# EAGLE design M514X (EAGLE 6.6.0)
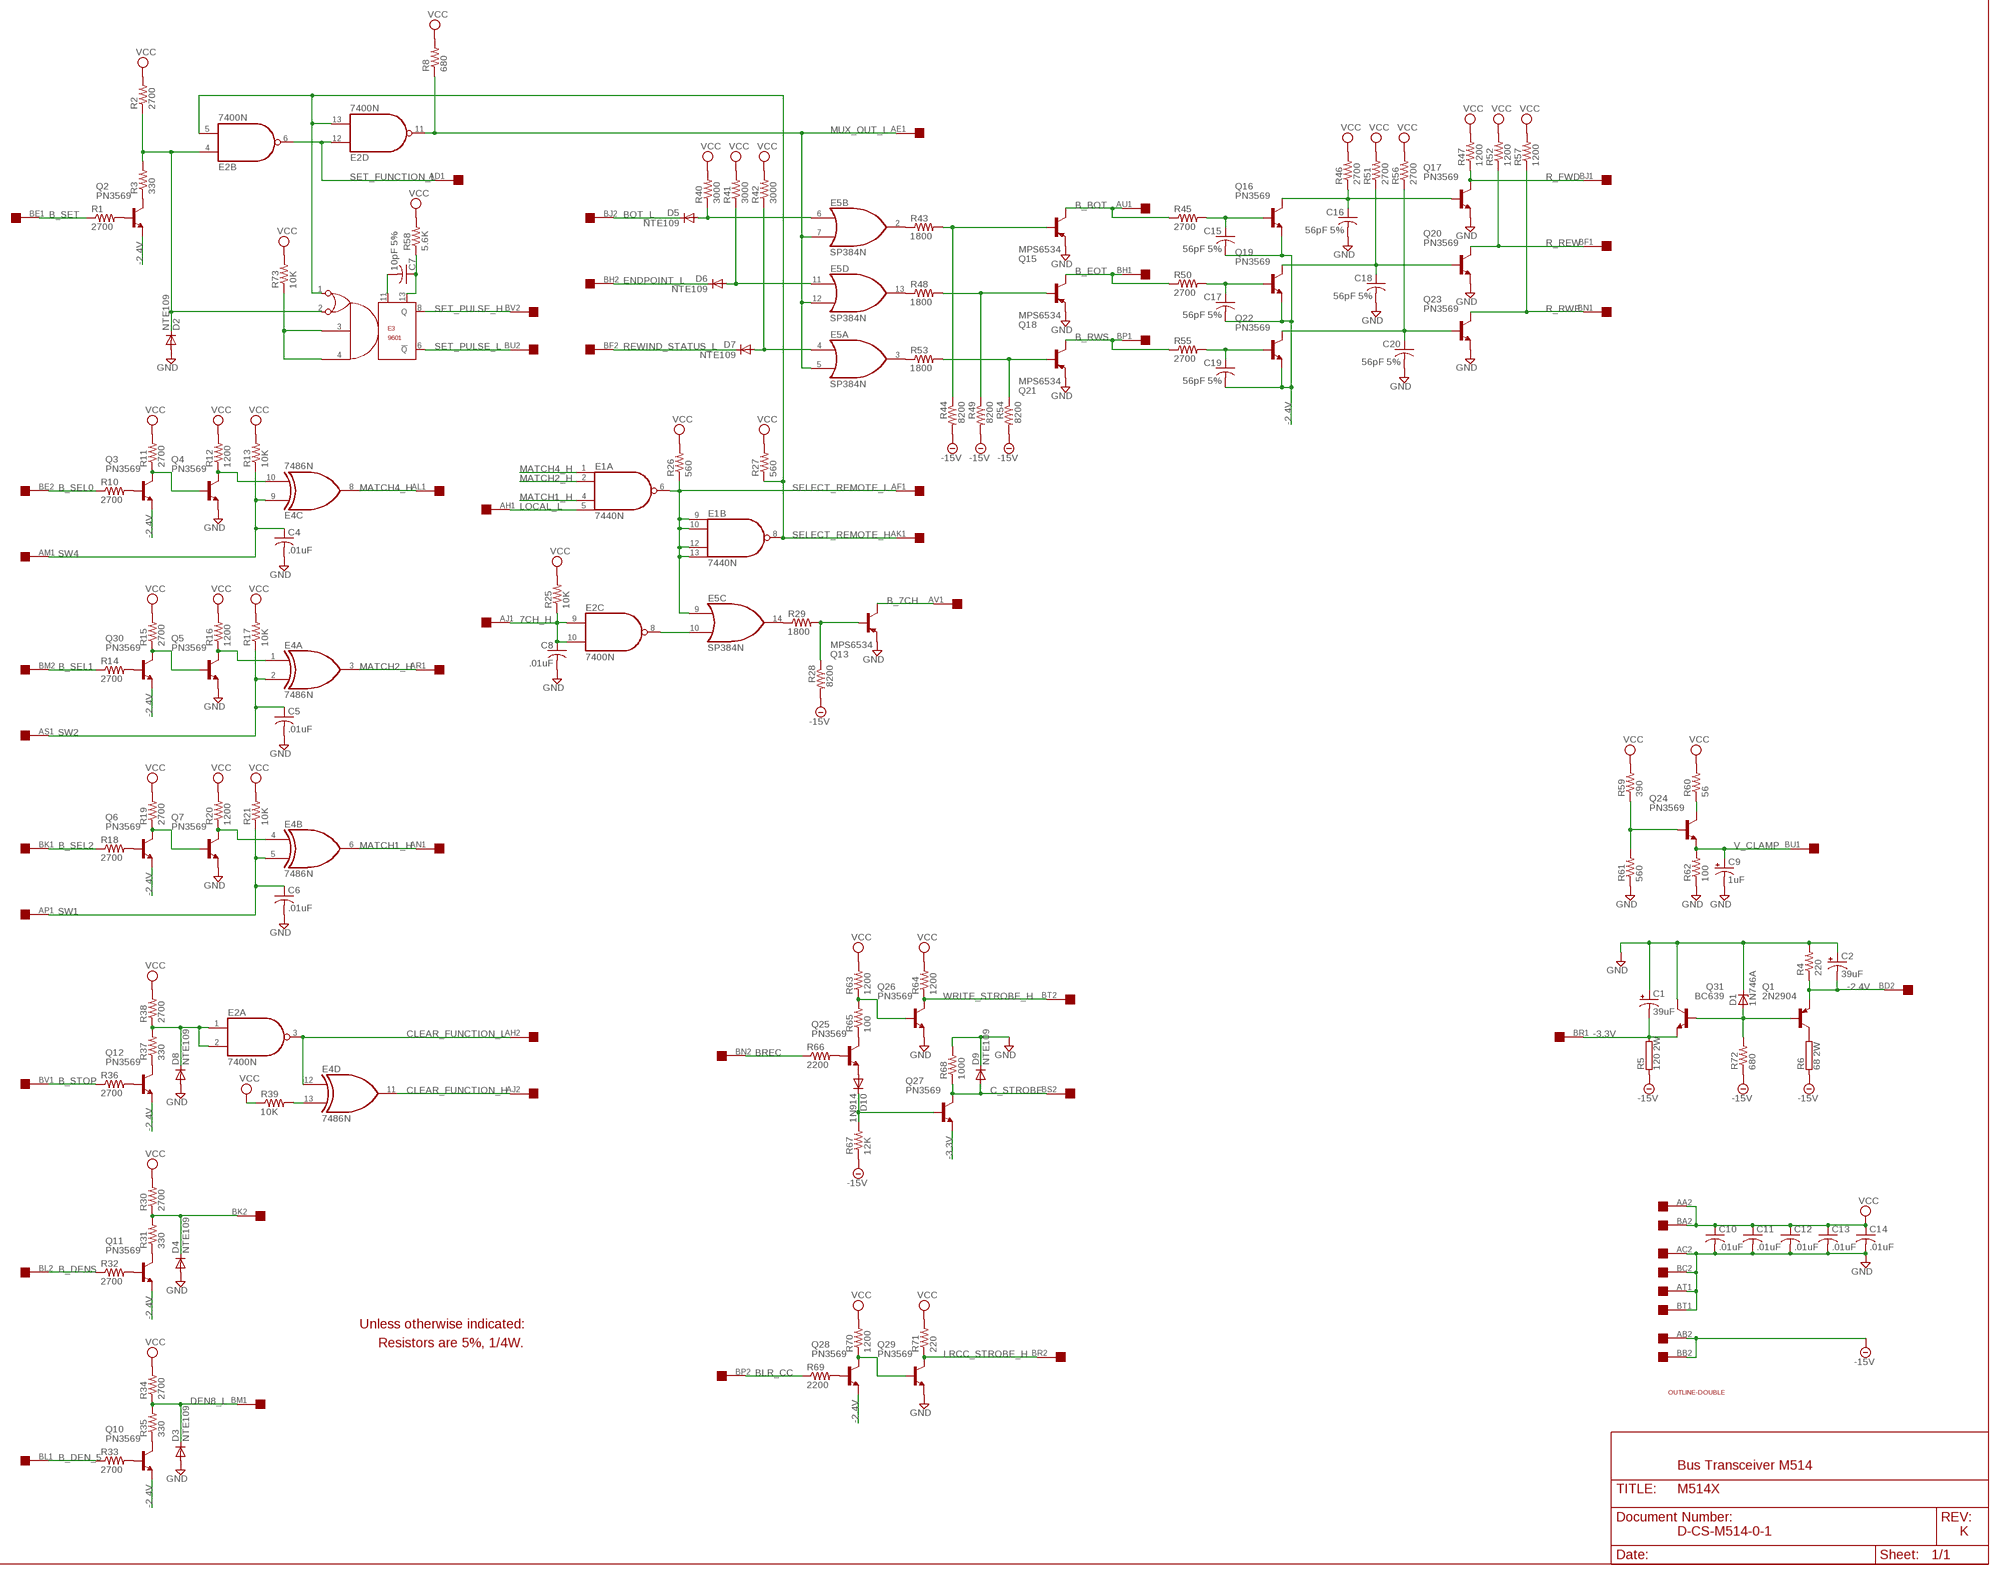
[diagram p0: schematic, sheet 1]

## Parts
C1  39uF  CPOL-USE20-8AXIAL  [E12-8]
C2  39uF  CPOL-USE20-8AXIAL  [E12-8]
C4  .01uF  C-US050-025X075  [C050-025X075]
C5  .01uF  C-US050-025X075  [C050-025X075]
C6  .01uF  C-US050-025X075  [C050-025X075]
C7  10pF 5%  C-US050-025X075  [C050-025X075]
C8  .01uF  C-US050-025X075  [C050-025X075]
C9  1uF  CPOL-USE15-5AXIAL  [E15-5]
C10  .01uF  C-US050-025X075  [C050-025X075]
C11  .01uF  C-US050-025X075  [C050-025X075]
C12  .01uF  C-US050-025X075  [C050-025X075]
C13  .01uF  C-US050-025X075  [C050-025X075]
C14  .01uF  C-US050-025X075  [C050-025X075]
C15  56pF 5%  C-US050-025X075  [C050-025X075]
C16  56pF 5%  C-US050-025X075  [C050-025X075]
C17  56pF 5%  C-US050-025X075  [C050-025X075]
C18  56pF 5%  C-US050-025X075  [C050-025X075]
C19  56pF 5%  C-US050-025X075  [C050-025X075]
C20  56pF 5%  C-US050-025X075  [C050-025X075]
D1  1N746A  ZENER-DIODEDO35Z10  [DO35Z10]
D2  NTE109  1N4148DO35-10  [DO35-10]
D3  NTE109  1N4148DO35-10  [DO35-10]
D4  NTE109  1N4148DO35-10  [DO35-10]
D5  NTE109  1N4148DO35-10  [DO35-10]
D6  NTE109  1N4148DO35-10  [DO35-10]
D7  NTE109  1N4148DO35-10  [DO35-10]
D8  NTE109  1N4148DO35-10  [DO35-10]
D9  NTE109  1N4148DO35-10  [DO35-10]
D10  1N914  1N4148DO35-10  [DO35-10]
E1  7440N  74S20N  [DIL14]
E2  7400N  [DIL14]
E3  9601  [DIL14]
E4  7486N  [DIL14]
E5  SP384N  [DIL14]
Q1  2N2904  2N3635  [TO39]
Q2  PN3569  2N3439  [TO5]
Q3  PN3569  2N3439  [TO5]
Q4  PN3569  2N3439  [TO5]
Q5  PN3569  2N3439  [TO5]
Q6  PN3569  2N3439  [TO5]
Q7  PN3569  2N3439  [TO5]
Q10  PN3569  2N3439  [TO5]
Q11  PN3569  2N3439  [TO5]
Q12  PN3569  2N3439  [TO5]
Q13  MPS6534  2N3635  [TO39]
Q15  MPS6534  2N3635  [TO39]
Q16  PN3569  2N3439  [TO5]
Q17  PN3569  2N3439  [TO5]
Q18  MPS6534  2N3635  [TO39]
Q19  PN3569  2N3439  [TO5]
Q20  PN3569  2N3439  [TO5]
Q21  MPS6534  2N3635  [TO39]
Q22  PN3569  2N3439  [TO5]
Q23  PN3569  2N3439  [TO5]
Q24  PN3569  2N3439  [TO5]
Q25  PN3569  2N3439  [TO5]
Q26  PN3569  2N3439  [TO5]
Q27  PN3569  2N3439  [TO5]
Q28  PN3569  2N3439  [TO5]
Q29  PN3569  2N3439  [TO5]
Q30  PN3569  2N3439  [TO5]
Q31  BC639  2N3439  [TO5]
R1  2700  R-US_0207/10  [0207/10]
R2  2700  R-US_0207/10  [0207/10]
R3  330  R-US_0207/10  [0207/10]
R4  220  R-US_0207/10  [0207/10]
R5  120 2W  RKH206-8  [KH206-8]
R6  68 2W  RKH206-8  [KH206-8]
R8  680  R-US_0207/10  [0207/10]
R10  2700  R-US_0207/10  [0207/10]
R11  2700  R-US_0207/10  [0207/10]
R12  1200  R-US_0207/10  [0207/10]
R13  10K  R-US_0207/10  [0207/10]
R14  2700  R-US_0207/10  [0207/10]
R15  2700  R-US_0207/10  [0207/10]
R16  1200  R-US_0207/10  [0207/10]
R17  10K  R-US_0207/10  [0207/10]
R18  2700  R-US_0207/10  [0207/10]
R19  2700  R-US_0207/10  [0207/10]
R20  1200  R-US_0207/10  [0207/10]
R21  10K  R-US_0207/10  [0207/10]
R25  10K  R-US_0207/10  [0207/10]
R26  560  R-US_0207/10  [0207/10]
R27  560  R-US_0207/10  [0207/10]
R28  8200  R-US_0207/10  [0207/10]
R29  1800  R-US_0207/10  [0207/10]
R30  2700  R-US_0207/10  [0207/10]
R31  330  R-US_0207/10  [0207/10]
R32  2700  R-US_0207/10  [0207/10]
R33  2700  R-US_0207/10  [0207/10]
R34  2700  R-US_0207/10  [0207/10]
R35  330  R-US_0207/10  [0207/10]
R36  2700  R-US_0207/10  [0207/10]
R37  330  R-US_0207/10  [0207/10]
R38  2700  R-US_0207/10  [0207/10]
R39  10K  R-US_0207/10  [0207/10]
R40  3000  R-US_0207/10  [0207/10]
R41  3000  R-US_0207/10  [0207/10]
R42  3000  R-US_0207/10  [0207/10]
R43  1800  R-US_0207/10  [0207/10]
R44  8200  R-US_0207/10  [0207/10]
R45  2700  R-US_0207/10  [0207/10]
R46  2700  R-US_0207/10  [0207/10]
R47  1200  R-US_0207/10  [0207/10]
R48  1800  R-US_0207/10  [0207/10]
R49  8200  R-US_0207/10  [0207/10]
R50  2700  R-US_0207/10  [0207/10]
R51  2700  R-US_0207/10  [0207/10]
R52  1200  R-US_0207/10  [0207/10]
R53  1800  R-US_0207/10  [0207/10]
R54  8200  R-US_0207/10  [0207/10]
R55  2700  R-US_0207/10  [0207/10]
R56  2700  R-US_0207/10  [0207/10]
R57  1200  R-US_0207/10  [0207/10]
R58  5.6K  R-US_0207/10  [0207/10]
R59  390  R-US_0207/10  [0207/10]
R60  56  R-US_0207/10  [0207/10]
R61  560  R-US_0207/10  [0207/10]
R62  100  R-US_0207/10  [0207/10]
R63  1200  R-US_0207/10  [0207/10]
R64  1200  R-US_0207/10  [0207/10]
R65  100  R-US_0207/10  [0207/10]
R66  2200  R-US_0207/10  [0207/10]
R67  12K  R-US_0207/10  [0207/10]
R68  1000  R-US_0207/10  [0207/10]
R69  2200  R-US_0207/10  [0207/10]
R70  1200  R-US_0207/10  [0207/10]
R71  220  R-US_0207/10  [0207/10]
R72  680  R-US_0207/10  [0207/10]
R73  10K  R-US_0207/10  [0207/10]
U$1  DOUBLE  [EDGE-CON4]
U$2  OUTLINE-DOUBLE  [DOUBLE]

## Nets
7CH_H: C8.1 E2.9(C:I0) E2.10(C:I1) R25.1 U$1.AJ1
-2.4V [Supply]: C2.- C15.2 C17.2 C19.2 Q1.1(E) Q2.1(E) Q3.1(E) Q6.1(E) Q10.1(E) Q11.1(E) Q12.1(E) Q16.1(E) Q19.1(E) Q22.1(E) Q28.1(E) Q30.1(E) R4.1 U$1.BD2
-3.3V [Supply]: C1.- Q27.1(E) Q31.1(E) R5.2 U$1.BR1
-15V [Supply]: R5.1 R6.1 R28.2 R44.2 R49.2 R54.2 R67.1 R72.1 U$1.AB2 U$1.BB2
B_7CH: Q13.3(C) U$1.AV1
B_BOT: Q15.3(C) R45.1 U$1.AU1
B_DEN_5: R33.1 U$1.BL1
B_DENS: R32.1 U$1.BL2
B_EOT: Q18.3(C) R50.1 U$1.BH1
B_RWS: Q21.3(C) R55.1 U$1.BP1
B_SEL0: R10.1 U$1.BE2
B_SEL1: R14.1 U$1.BM2
B_SEL2: R18.1 U$1.BK1
B_SET: R1.1 U$1.BE1
B_STOP: R36.1 U$1.BV1
BLR_CC: R69.1 U$1.BP2
BOT_L: D5.C U$1.BJ2
BREC: R66.1 U$1.BN2
C_STROBE: D9.A Q27.3(C) R68.1 U$1.BS2
CLEAR_FUNCTION_H: E4.11(D:O) U$1.AJ2
CLEAR_FUNCTION_L: E2.3(A:O) E4.12(D:I0) U$1.AH2
DEN8_L [Supply]: D3.C R34.1 R35.2 U$1.BM1
ENDPOINT_L: D6.C U$1.BH2
GND [Supply]: C1.+ C2.+ C4.2 C5.2 C6.2 C8.2 C9.- C10.2 C11.2 C12.2 C13.2 C14.2 C16.2 C18.2 C20.2 D1.C D2.A D3.A D4.A D8.A D9.C Q4.1(E) Q5.1(E) Q7.1(E) Q13.1(E) Q15.1(E) Q17.1(E) Q18.1(E) Q20.1(E) Q21.1(E) Q23.1(E) Q26.1(E) Q29.1(E) Q31.3(C) R4.2 R61.1 R62.1 R68.2 U$1.AC2 U$1.AT1 U$1.BC2 U$1.BT1
LOCAL_L: E1.5(A:I3) U$1.AH1
LRCC_STROBE_H: Q29.3(C) R71.1 U$1.BR2
MATCH1_H: E1.4(A:I2) E4.6(B:O) U$1.AN1
MATCH2_H: E1.2(A:I1) E4.3(A:O) U$1.AR1
MATCH4_H: E1.1(A:I0) E4.8(C:O) U$1.AL1
MUX_OUT_L: E2.11(D:O) E5.5(A:I1) E5.7(B:I1) E5.12(D:I1) R8.1 U$1.AE1
N$1: C7.1 E3.13 R58.1
N$2: Q2.3(C) R3.1
N$3: Q2.2(B) R1.2
N$4: D2.C E2.4(B:I0) E3.2 R2.1 R3.2
N$5: E3.3 E3.4 R73.1
N$6: C7.2 E3.11
N$7: Q1.3(C) R6.2
N$8: D1.A Q1.2(B) Q31.2(B) R72.2
N$9: Q3.2(B) R10.2
N$10: E2.8(C:O) E5.10(C:I1)
N$12: Q3.3(C) Q4.2(B) R11.1
N$13: E4.10(C:I1) Q4.3(C) R12.1
N$15: Q12.2(B) R36.2
N$16: Q30.2(B) R14.2
N$17: Q5.2(B) Q30.3(C) R15.1
N$18: E4.1(A:I0) Q5.3(C) R16.1
N$20: Q6.2(B) R18.2
N$21: Q6.3(C) Q7.2(B) R19.1
N$22: E4.4(B:I0) Q7.3(C) R20.1
N$23: Q12.3(C) R37.1
N$24: D5.A E5.6(B:I0) R40.1
N$25: D8.C E2.1(A:I0) E2.2(A:I1) R37.2 R38.1
N$26: Q11.3(C) R31.1
N$27: D6.A E5.11(D:I0) R41.1
N$28: Q11.2(B) R32.2
N$29 [Supply]: D4.C R30.1 R31.2 U$1.BK2
N$30: Q10.3(C) R35.1
N$31: D7.A E5.4(A:I0) R42.1
N$32: Q10.2(B) R33.2
N$33: E5.2(B:O) R43.1
N$34: E5.13(D:O) R48.1
N$35: E5.3(A:O) R53.1
N$36: E5.14(C:O) R29.1
N$37: Q13.2(B) R28.1 R29.2
N$38: Q15.2(B) R43.2 R44.1
N$39: Q18.2(B) R48.2 R49.1
N$40: Q21.2(B) R53.2 R54.1
N$41: E4.13(D:I1) R39.2
N$46: C19.1 Q22.2(B) R55.2
N$47: C17.1 Q19.2(B) R50.2
N$48: C15.1 Q16.2(B) R45.2
N$49: Q28.2(B) R69.2
N$50: Q24.2(B) R59.1 R61.2
N$51: Q24.3(C) R60.1
N$52: C20.1 Q22.3(C) Q23.2(B) R56.1
N$53: C16.1 Q16.3(C) Q17.2(B) R46.1
N$54: C18.1 Q19.3(C) Q20.2(B) R51.1
N$55: Q28.3(C) Q29.2(B) R70.1
N$56: Q25.2(B) R66.2
N$57: D10.A Q25.1(E)
N$58: D10.C Q27.2(B) R67.2
N$59: Q25.3(C) R65.1
N$60: Q26.2(B) R63.1 R65.2
R_FWD: Q17.3(C) R47.1 U$1.BJ1
R_REW: Q20.3(C) R52.1 U$1.BF1
R_RWE: Q23.3(C) R57.1 U$1.BN1
REWIND_STATUS_L: D7.C U$1.BF2
SELECT_REMOTE_H: E1.8(B:O) E2.5(B:I1) E2.13(D:I1) E3.1 R27.1 U$1.AK1
SELECT_REMOTE_L: E1.6(A:O) E1.9(B:I0) E1.10(B:I1) E1.12(B:I2) E1.13(B:I3) E5.9(C:I0) R26.1 U$1.AF1
SET_FUNCTION_L: E2.6(B:O) E2.12(D:I0) U$1.AD1
SET_PULSE_H: E3.8(Q) U$1.BV2
SET_PULSE_L: E3.6(!Q) U$1.BU2
SW1: C6.1 E4.5(B:I1) R21.1 U$1.AP1
SW2: C5.1 E4.2(A:I1) R17.1 U$1.AS1
SW4: C4.1 E4.9(C:I0) R13.1 U$1.AM1
V_CLAMP: C9.+ Q24.1(E) R62.2 U$1.BU1
VCC [Supply]: C10.1 C11.1 C12.1 C13.1 C14.1 R2.2 R8.2 R11.2 R12.2 R13.2 R15.2 R16.2 R17.2 R19.2 R20.2 R21.2 R25.2 R26.2 R27.2 R30.2 R34.2 R38.2 R39.1 R40.2 R41.2 R42.2 R46.2 R47.2 R51.2 R52.2 R56.2 R57.2 R58.2 R59.2 R60.2 R63.2 R64.2 R70.2 R71.2 R73.2 U$1.AA2 U$1.BA2
WRITE_STROBE_H: Q26.3(C) R64.1 U$1.BT2
Unconnected: U$1.AA1 U$1.AB1 U$1.AC1 U$1.AD2 U$1.AE2 U$1.AF2 U$1.AK2 U$1.AL2 U$1.AM2 U$1.AN2 U$1.AP2 U$1.AR2 U$1.AS2 U$1.AT2 U$1.AU2 U$1.AV2 U$1.BA1 U$1.BB1 U$1.BC1 U$1.BD1 U$1.BS1

## Notes on the sheet
- Unless otherwise indicated:
- Resistors are 5%, 1/4W.
- Bus Transceiver M514
- D-CS-M514-0-1 | K

## Power pins joined to a net without a drawn wire
GND: E1.7(P:GND) E2.7(P:GND) E3.7(GND) E4.7(P:GND) E5.1(GND)
VCC: E1.14(P:VCC) E2.14(P:VCC) E3.14(VCC) E4.14(P:VCC) E5.8(VCC)

## Library data of the parts
C1 C2 = dec-con:CPOL-USE20-8AXIAL: A 0.8 inch electrolytic.
C4-C8 C10-C20 = rcl:C-US: CAPACITOR, American symbol
C9 = rcl:CPOL-US: POLARIZED CAPACITOR, American symbol
D1 = diode:ZENER-DIODE: Z-Diode
D2-D10 = diode:1N4148: DIODE high speed (Philips)
E1 = 74xx-us:74*20: Dual 4-input NAND gate
E2 = 74xx-us:74*00: Quad 2-input NAND gate
E3 = dec-con:9601: DEC9601 monstable
E4 = 74xx-us:74*86: Quad 2-input EXCLUSIV-OR (XOR) gate
E5 = dec-con:SP384: Quad OR gate
Q1 Q13 Q15 Q18 Q21 = transistor-pnp:2N3635*: PNP Transistror
Q2-Q7 Q10-Q12 Q16 Q17 Q19 Q20 Q22-Q31 = transistor-npn:2N3439: NPN Transistor
R1-R4 R8 R10-R21 R25-R73 = rcl:R-US_: RESISTOR, American symbol
R5 R6 = resistor-power:R: Power Resitor; OC_FARNELL: unknown; OC_NEWARK: unknown
U$1 = dec-con:DOUBLE: Double-Height DEC board
U$2 = dec-con:OUTLINE-*: Board outlines for DEC boards.

## Net classes
1 Supply: width 0.813 mm

## Board
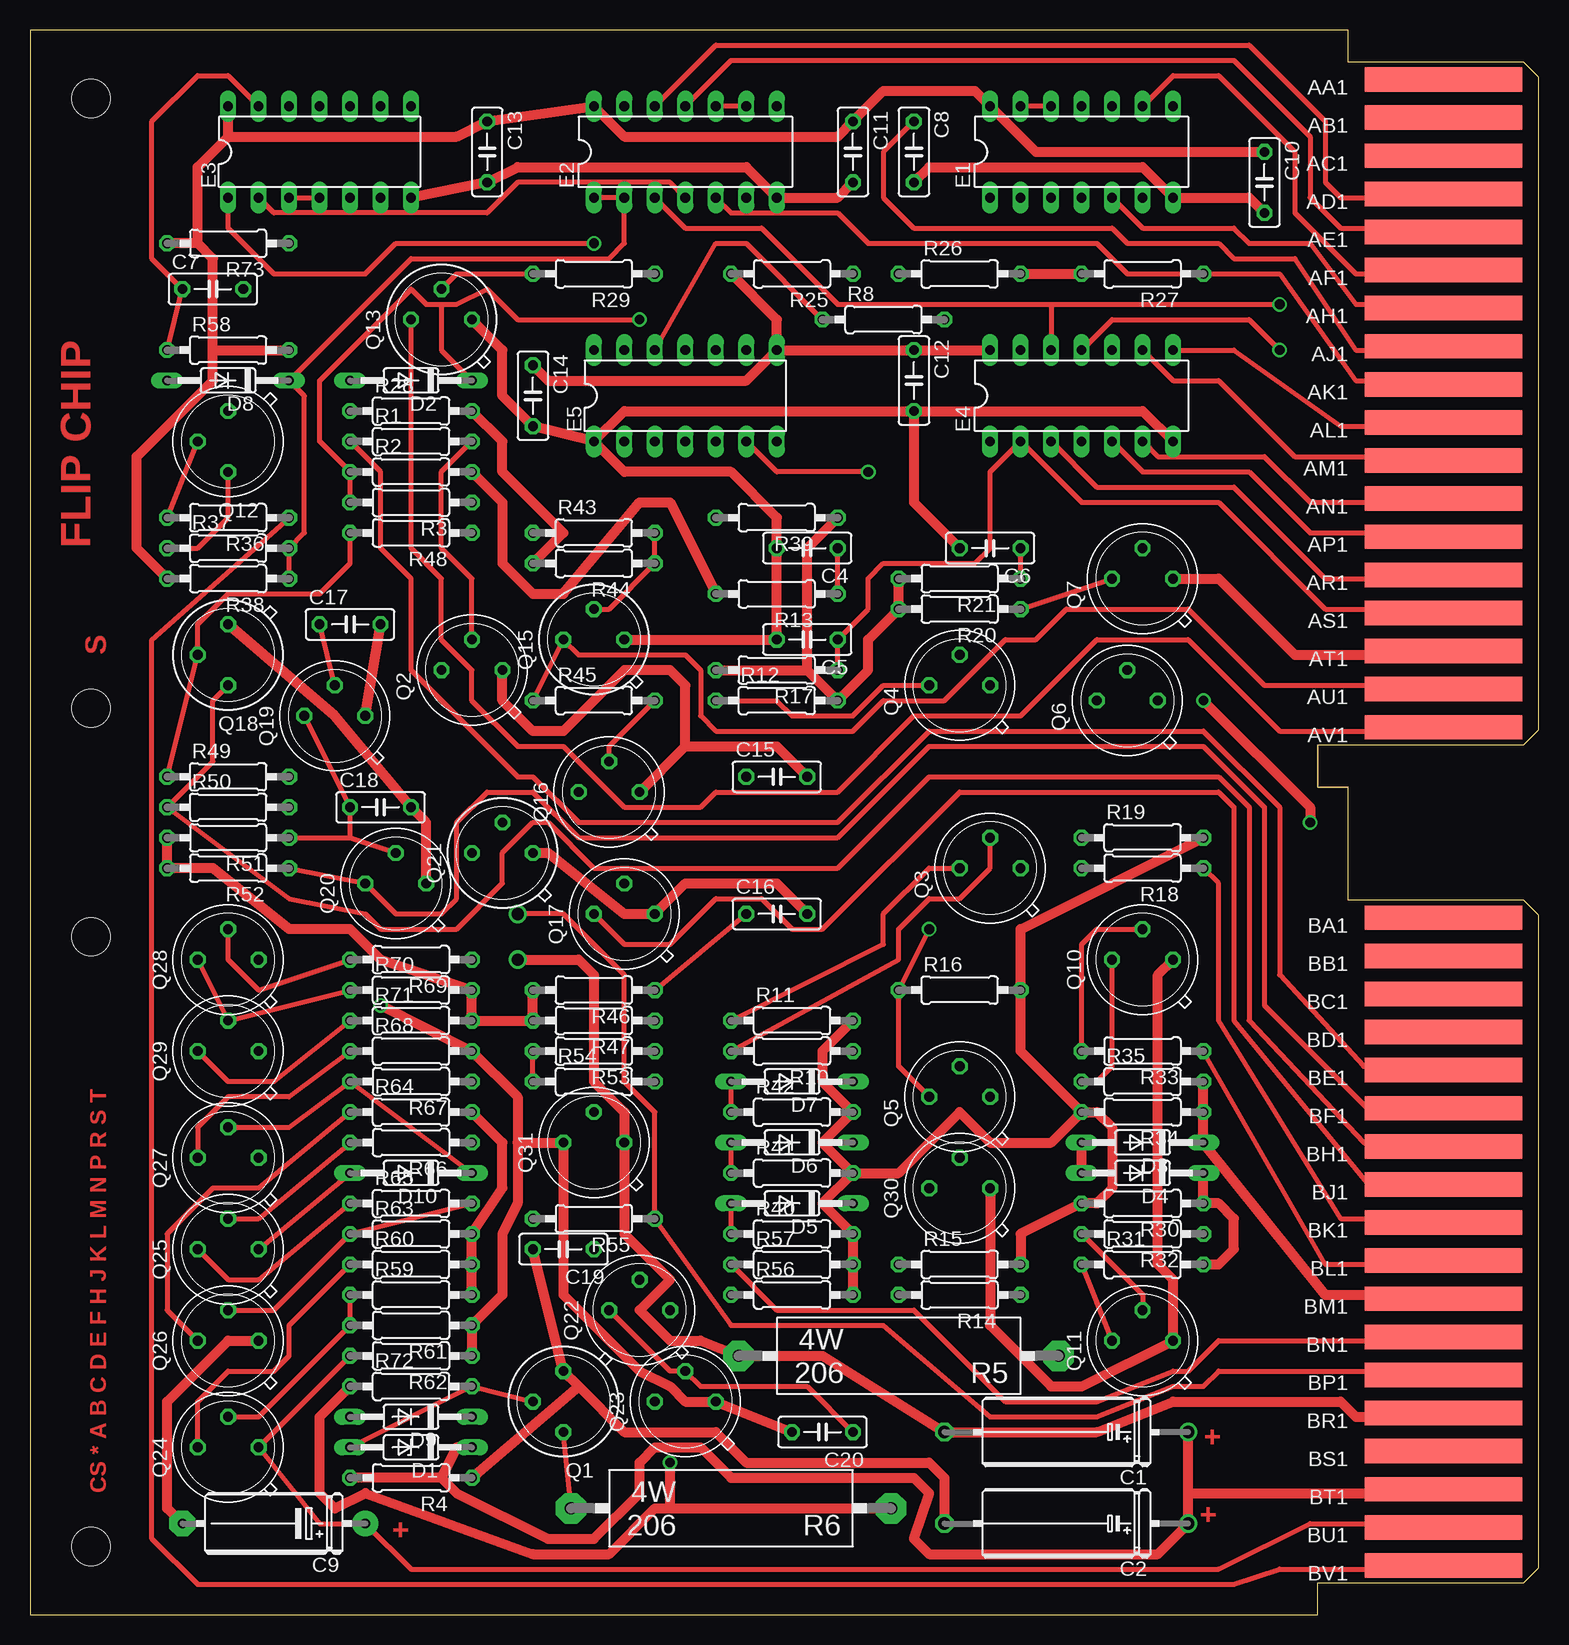
[diagram p1: board, top side]
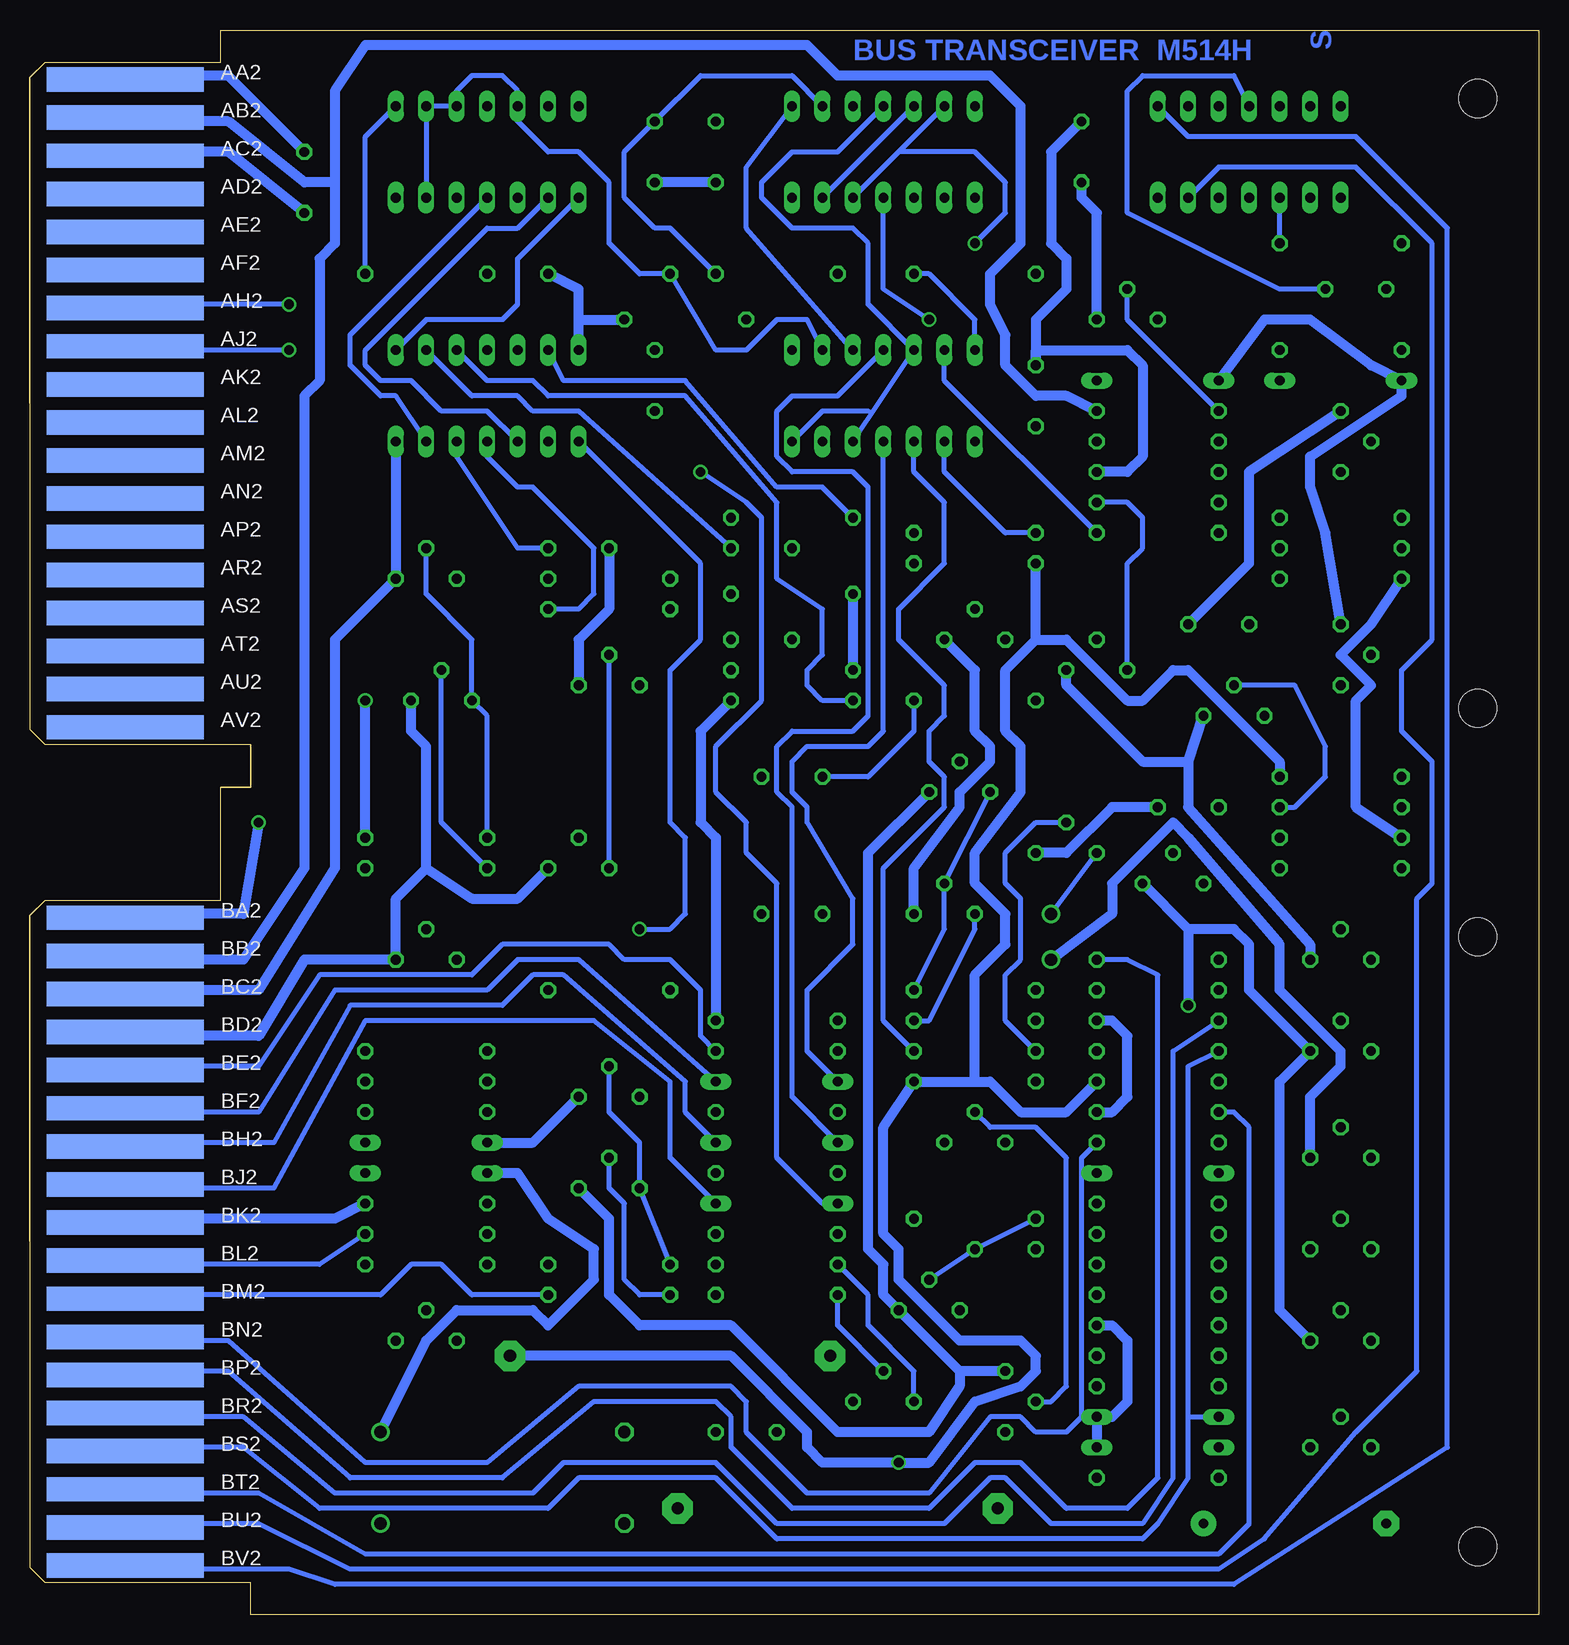
[diagram p2: board, bottom side, seen from below]

Size 125.73 x 132.08 mm. Coordinates in mm from the lower left corner, seen from the top.
Copper layers (1+16): Top 0.035mm / dielectric 1.5mm / Bottom 0.035mm
Design rules "16mils": minimum track width 16mil, minimum drill 32mil, track to track 15mil, track to pad 10mil, pad to pad 10mil, via to via 10mil, smd to smd 10mil, copper to edge 13mil, drill to drill 10mil, minimum pad ring 10mil, minimum via ring 8mil, stop-mask expansion 0mil, vias tented up to drill 0mil, thermal gap 10mil

### Footprints (pad centres in the part's own frame; a part is rotated, then mirrored left to right if it is on the bottom)
E12-8 = drill 1.016: + -10.16,0 | drill 1.016 octagon: - 10.16,0
C050-025X075 = drill 0.813 octagon: 1 -2.54,0; 2 2.54,0
E15-5 = drill 0.813 pad 2.159: + -7.62,0 | drill 0.813 pad 2.159 octagon: - 7.62,0
DO35Z10 = drill 0.813 long: A 5.08,0; C -5.08,0
DO35-10 = drill 0.813 long: A 5.08,0; C -5.08,0
DIL14 = drill 0.813 long: 1 -7.62,-3.81; 2 -5.08,-3.81; 3 -2.54,-3.81; 4 0,-3.81; 5 2.54,-3.81; 6 5.08,-3.81; 7 7.62,-3.81; 8 7.62,3.81; 9 5.08,3.81; 10 2.54,3.81; 11 0,3.81; 12 -2.54,3.81; 13 -5.08,3.81; 14 -7.62,3.81
TO39 = drill 0.813 octagon: 1 0,-2.54; 2 2.54,0; 3 0,2.54
TO5 = drill 0.813 octagon: 1 0,-2.54; 2 2.54,0; 3 0,2.54
0207/10 = drill 0.813 octagon: 1 -5.08,0; 2 5.08,0
KH206-8 = drill 1.016 pad 2.54 octagon: 1 -13.335,0; 2 13.335,0
EDGE-CON4 = smd 13.106 x 2.032: AA1 7.938,4.128; AB1 7.938,7.303; AC1 7.938,10.477; AD1 7.938,13.652; AE1 7.938,16.828; AF1 7.938,20.003; AH1 7.938,23.177; AJ1 7.938,26.352; AK1 7.938,29.527; AL1 7.938,32.703; AM1 7.938,35.877; AN1 7.938,39.053; AP1 7.938,42.227; AR1 7.938,45.403; AS1 7.938,48.578; AT1 7.938,51.752; AU1 7.938,54.928; AV1 7.938,58.102; BA1 7.938,73.978; BB1 7.938,77.153; BC1 7.938,80.328; BD1 7.938,83.502; BE1 7.938,86.677; BF1 7.938,89.853; BH1 7.938,93.028; BJ1 7.938,96.203; BK1 7.938,99.377; BL1 7.938,102.552; BM1 7.938,105.728; BN1 7.938,108.903; BP1 7.938,112.078; BR1 7.938,115.252; BS1 7.938,118.427; BT1 7.938,121.603; BU1 7.938,124.778; BV1 7.938,127.953 | smd 13.106 x 2.032 bottom: AA2 7.938,4.128; AB2 7.938,7.303; AC2 7.938,10.477; AD2 7.938,13.652; AE2 7.938,16.828; AF2 7.938,20.003; AH2 7.938,23.177; AJ2 7.938,26.352; AK2 7.938,29.527; AL2 7.938,32.703; AM2 7.938,35.877; AN2 7.938,39.053; AP2 7.938,42.227; AR2 7.938,45.403; AS2 7.938,48.578; AT2 7.938,51.752; AU2 7.938,54.928; AV2 7.938,58.102; BA2 7.938,73.978; BB2 7.938,77.153; BC2 7.938,80.328; BD2 7.938,83.502; BE2 7.938,86.677; BF2 7.938,89.853; BH2 7.938,93.028; BJ2 7.938,96.203; BK2 7.938,99.377; BL2 7.938,102.552; BM2 7.938,105.728; BN2 7.938,108.903; BP2 7.938,112.078; BR2 7.938,115.252; BS2 7.938,118.427; BT2 7.938,121.603; BU2 7.938,124.778; BV2 7.938,127.953
DOUBLE = hole 3.175: 120.65,56.515; 120.65,5.715; 120.65,75.565; 120.65,126.365

### Placement (x,y rotation side)
C1  86.36,15.24 180 top
C2  86.36,7.62 180 top
C4  64.77,88.9 180 top
C5  64.77,81.28 180 top
C6  80.01,88.9 180 top
C7  15.24,110.49 0 top
C8  73.66,121.92 270 top
C9  20.32,7.62 180 top
C10  102.87,119.38 270 top
C11  68.58,121.92 270 top
C12  73.66,102.87 270 top
C13  38.1,121.92 270 top
C14  41.91,101.6 270 top
C15  62.23,69.85 0 top
C16  62.23,58.42 0 top
C17  26.67,82.55 0 top
C18  29.21,67.31 0 top
C19  44.45,30.48 180 top
C20  66.04,15.24 180 top
D1  31.75,13.97 180 top
D2  31.75,102.87 180 top
D3  92.71,39.37 180 top
D4  92.71,36.83 180 top
D5  63.5,34.29 180 top
D6  63.5,39.37 180 top
D7  63.5,44.45 180 top
D8  16.51,102.87 180 top
D9  31.75,16.51 180 top
D10  31.75,36.83 180 top
E1  87.63,121.92 0 top
E2  54.61,121.92 0 top
E3  24.13,121.92 0 top
E4  87.63,101.6 0 top
E5  54.61,101.6 0 top
Q1  44.45,17.78 180 top
Q2  36.83,78.74 90 top
Q3  80.01,62.23 90 top
Q4  77.47,77.47 90 top
Q5  77.47,43.18 90 top
Q6  91.44,76.2 90 top
Q7  92.71,86.36 90 top
Q10  92.71,54.61 90 top
Q11  92.71,22.86 90 top
Q12  16.51,97.79 180 top
Q13  34.29,107.95 90 top
Q15  46.99,81.28 90 top
Q16  48.26,68.58 90 top
Q17  49.53,58.42 90 top
Q18  16.51,80.01 180 top
Q19  25.4,74.93 90 top
Q20  30.48,60.96 90 top
Q21  39.37,63.5 90 top
Q22  50.8,25.4 90 top
Q23  54.61,17.78 90 top
Q24  16.51,13.97 90 top
Q25  16.51,30.48 90 top
Q26  16.51,22.86 90 top
Q27  16.51,38.1 90 top
Q28  16.51,54.61 90 top
Q29  16.51,46.99 90 top
Q30  77.47,35.56 90 top
Q31  46.99,39.37 90 top
R1  31.75,97.79 0 top
R2  31.75,95.25 0 top
R3  31.75,92.71 180 top
R4  31.75,11.43 180 top
R5  72.39,21.59 180 top
R6  58.42,8.89 180 top
R8  71.12,107.95 0 top
R10  63.5,46.99 180 top
R11  63.5,49.53 0 top
R12  62.23,76.2 0 top
R13  62.23,85.09 180 top
R14  77.47,26.67 180 top
R15  77.47,29.21 0 top
R16  77.47,52.07 0 top
R17  62.23,78.74 180 top
R18  92.71,62.23 180 top
R19  92.71,64.77 0 top
R20  77.47,83.82 180 top
R21  77.47,86.36 180 top
R25  63.5,111.76 180 top
R26  77.47,111.76 0 top
R27  92.71,111.76 180 top
R28  31.75,100.33 0 top
R29  46.99,111.76 180 top
R30  92.71,34.29 180 top
R31  92.71,29.21 0 top
R32  92.71,31.75 180 top
R33  92.71,46.99 180 top
R34  92.71,41.91 180 top
R35  92.71,44.45 0 top
R36  16.51,91.44 180 top
R37  16.51,88.9 0 top
R38  16.51,86.36 180 top
R39  62.23,91.44 180 top
R40  63.5,31.75 0 top
R41  63.5,36.83 0 top
R42  63.5,41.91 0 top
R43  46.99,90.17 0 top
R44  46.99,87.63 180 top
R45  46.99,76.2 0 top
R46  46.99,52.07 180 top
R47  46.99,49.53 180 top
R48  31.75,90.17 180 top
R49  16.51,69.85 0 top
R50  16.51,67.31 0 top
R51  16.51,64.77 180 top
R52  16.51,62.23 180 top
R53  46.99,46.99 180 top
R54  46.99,44.45 0 top
R55  46.99,33.02 180 top
R56  63.5,26.67 0 top
R57  63.5,29.21 0 top
R58  16.51,105.41 0 top
R59  31.75,26.67 0 top
R60  31.75,29.21 0 top
R61  31.75,24.13 180 top
R62  31.75,21.59 180 top
R63  31.75,31.75 0 top
R64  31.75,41.91 0 top
R65  31.75,34.29 0 top
R66  31.75,39.37 180 top
R67  31.75,44.45 180 top
R68  31.75,46.99 0 top
R69  31.75,54.61 180 top
R70  31.75,52.07 0 top
R71  31.75,49.53 0 top
R72  31.75,19.05 0 top
R73  16.51,114.3 180 top
U$1  125.73,132.08 180 top
U$2  125.73,132.08 180 top
U$4  [FLIPCHIP]  0,69.85 0 top

### Tracks (layer width: path | path; a pad name or v marks a point on that pad's centre or on a via)
7CH_H
  Top 0.406: U$1.AJ1 117.17,105.74 116.84,105.41 110.49,105.41 105.41,113.03 100.33,113.03 99.06,114.3 91.44,114.3 90.17,115.57 73.66,115.57 71.12,118.11 71.12,121.92 C8.1 | E2.9 E2.10
  Bottom 0.406: R25.1 72.39,115.57 73.66,115.57 76.2,118.11 76.2,121.92 C8.1 69.85,128.27 62.23,128.27 E2.9
-2.4V
  Top 0.813: Q10.1 93.98,53.34 93.98,29.21 95.25,27.94 Q11.1 87.63,19.05 85.09,19.05 80.01,24.13 Q30.1 | C2.- 76.2,11.43 74.93,12.7 59.69,12.7 57.15,15.24 49.53,15.24 45.72,19.05 | 45.72,19.05 Q1.1 C19.2 | C15.2 62.23,72.39 54.61,72.39 | Q16.1 54.61,72.39 | Q19.1 C17.2 | 54.61,72.39 54.61,77.47 53.34,78.74 49.53,78.74 44.45,73.66 41.91,73.66 39.37,76.2 Q2.1 | R4.1 45.72,19.05
  Bottom 0.813: Q1.1 48.26,20.32 | 48.26,20.32 48.26,19.05 50.8,15.24 58.42,15.24 67.31,24.13 74.93,24.13 77.47,26.67 77.47,33.02 Q30.1 | 48.26,20.32 Q22.1 54.61,26.67 54.61,29.21 55.88,30.48 55.88,63.5 Q16.1 | U$1.BD2 116.84,48.26 106.68,48.26 102.87,54.61 Q10.1 95.25,59.69 92.71,62.23 | 92.71,62.23 88.9,59.69 85.09,59.69 Q3.1 | 92.71,62.23 92.71,72.39 93.98,73.66 Q6.1 | Q28.1 19.05,55.88 29.21,67.31 29.21,71.12 | 29.21,71.12 Q19.1 | 29.21,71.12 33.02,71.12 39.37,77.47 Q2.1 | Q12.1 24.13,95.25 24.13,87.63 C17.2
-3.3V  (via drill 1.02)
  Top 0.813: U$1.BR1 117.17,16.84 116.84,16.51 110.49,16.51 109.22,17.78 95.25,17.78 88.9,15.24 C1.- 66.04,21.59 R5.2 55.88,22.86 53.34,22.86 50.8,25.4 53.34,27.94 49.53,31.75 Q31.1 49.53,41.91 46.99,44.45 46.99,53.34 45.72,54.61 v40.64,54.61
  Bottom 0.813: Q27.1 19.05,43.18 16.51,45.72 16.51,46.99 21.59,52.07 21.59,55.88 29.21,64.77 30.48,66.04 35.56,60.96 35.56,58.42 v40.64,54.61
-15V  (via drill 0.81)
  Top 0.813: 53.34,8.89 R6.1 | 53.34,8.89 v53.34,12.7 | 53.34,8.89 52.07,8.89 48.26,5.08 41.91,5.08 27.94,10.16 25.4,8.89 24.13,10.16 24.13,16.51 R72.1 | R28.2 39.37,97.79 39.37,95.25 44.45,90.17 R44.2
  Bottom 0.813: U$1.BB2 116.84,54.61 107.95,54.61 102.87,62.23 102.87,101.6 101.6,102.87 101.6,113.03 100.33,114.3 100.33,119.38 | 100.33,119.38 100.33,127 97.79,130.81 60.96,130.81 58.42,128.27 45.72,128.27 43.18,125.73 43.18,114.3 45.72,111.76 45.72,109.22 44.45,106.68 44.45,104.14 41.91,101.6 39.37,101.6 R28.2 | U$1.AB2 116.84,124.46 109.22,124.46 102.87,119.38 100.33,119.38 | R67.1 39.37,41.91 43.18,41.91 45.72,44.45 46.99,44.45 | 46.99,44.45 R54.2 54.61,40.64 54.61,31.75 53.34,30.48 53.34,27.94 48.26,22.86 43.18,22.86 41.91,21.59 41.91,20.32 43.18,19.05 46.99,17.78 50.8,12.7 v53.34,12.7 59.69,12.7 60.96,13.97 60.96,15.24 67.31,21.59 R5.1 | 41.91,81.28 R44.2 | 41.91,81.28 44.45,78.74 44.45,73.66 43.18,72.39 43.18,68.58 46.99,63.5 46.99,60.96 44.45,58.42 44.45,55.88 46.99,53.34 46.99,44.45 | 41.91,81.28 39.37,81.28 34.29,76.2 33.02,76.2 30.48,78.74 29.21,78.74 21.59,71.12 R49.2
B_7CH
  Top 0.406: U$1.AV1 117.23,74.05 116.84,73.66 104.14,73.66 96.52,81.28 88.9,81.28 82.55,74.93 73.66,74.93 67.31,68.58 57.15,68.58 55.88,67.31 49.53,67.31 44.45,72.39 40.64,72.39 36.83,76.2 36.83,78.74 34.29,81.28 34.29,86.36 31.75,88.9 Q13.3
B_BOT
  Top 0.406: U$1.AU1 117.17,77.14 116.84,77.47 102.87,77.47 96.52,83.82 86.36,83.82 83.82,81.28 81.28,81.28 76.2,76.2 71.12,76.2 68.58,73.66 57.15,73.66 55.88,74.93 55.88,78.74 54.61,80.01 45.72,80.01 Q15.3 R45.1
B_DEN_5
  Top 0.406: U$1.BL1 117.17,29.54 116.84,29.21 107.95,29.21 R33.1
B_DENS
  Bottom 0.406: U$1.BL2 116.84,29.21 101.6,29.21 R32.1
B_EOT
  Top 0.406: U$1.BH1 117.17,39.04 116.84,39.37 111.12,39.37 101.6,49.53 101.6,67.31 99.06,69.85 74.93,69.85 67.31,62.23 46.99,62.23 43.18,66.04 41.91,66.04 39.37,63.5 39.37,60.96 35.56,57.15 29.21,57.15 27.94,58.42 21.59,59.69 R50.1 15.24,71.12 15.24,76.2 Q18.3
B_RWS  (via drill 1.02)
  Top 0.406: U$1.BP1 117.17,19.99 116.84,20.32 99.06,20.32 97.79,19.05 95.25,19.05 88.9,16.51 80.01,16.51 71.12,24.13 58.42,24.13 R55.1 52.07,41.91 49.53,44.45 49.53,53.34 44.45,58.42 v40.64,58.42
  Bottom 0.406: v40.64,58.42 Q21.3
B_SEL0
  Bottom 0.406: U$1.BE2 116.84,45.72 106.68,45.72 101.6,53.34 88.9,53.34 86.36,55.88 77.47,55.88 76.2,54.61 72.39,54.61 69.85,52.07 69.85,48.26 R10.1
B_SEL1
  Bottom 0.406: U$1.BM2 116.84,26.67 96.52,26.67 93.98,29.21 91.44,29.21 88.9,26.67 R14.1
B_SEL2
  Top 0.406: U$1.BK1 117.14,32.72 116.84,33.02 109.22,33.02 99.06,49.53 99.06,60.96 R18.1
B_SET
  Top 0.406: U$1.BE1 117.17,45.39 116.84,45.72 111.12,45.72 104.14,53.34 104.14,67.31 97.79,73.66 74.93,73.66 67.31,66.04 45.72,66.04 41.91,69.85 40.64,69.85 31.75,78.74 31.75,86.36 29.21,88.9 29.21,95.25 R1.1
B_STOP
  Top 0.406: U$1.BV1 117.23,4.2 116.84,3.81 104.14,3.81 100.33,2.54 13.97,2.54 10.16,6.35 10.16,81.28 R36.1
BLR_CC
  Bottom 0.406: U$1.BP2 116.84,20.32 109.22,20.32 99.06,11.43 86.36,11.43 78.74,17.78 68.58,17.78 67.31,16.51 67.31,13.97 62.23,8.89 50.8,8.89 46.99,12.7 43.18,12.7 39.37,8.89 34.29,8.89 31.75,11.43 31.75,53.34 34.29,54.61 R69.1
BOT_L
  Bottom 0.406: U$1.BJ2 116.84,35.56 105.41,35.56 97.79,49.53 78.74,49.53 72.39,44.45 72.39,38.1 D5.C
BREC
  Bottom 0.406: U$1.BN2 116.84,22.86 109.22,22.86 97.79,12.7 87.63,12.7 80.01,19.05 67.31,19.05 66.04,17.78 66.04,15.24 60.96,10.16 50.8,10.16 45.72,16.51 43.18,16.51 41.91,15.24 39.37,15.24 38.1,16.51 38.1,38.1 R66.1
C_STROBE
  Top 0.406: Q27.3 13.97,40.64 16.51,43.18 21.59,43.18 R68.1
  Bottom 0.406: U$1.BS2 116.84,13.97 107.95,13.97 101.6,8.89 82.55,8.89 80.01,11.43 68.58,11.43 63.5,6.35 33.02,6.35 31.75,7.62 29.21,11.43 29.21,16.51 | 29.21,16.51 D9.A | R68.1 29.21,45.72 29.21,16.51
CLEAR_FUNCTION_H  (via drill 0.81)
  Top 0.406: v104.14,105.41 101.6,107.95 90.17,107.95 E4.11
  Bottom 0.406: U$1.AJ2 116.84,105.41 v104.14,105.41
CLEAR_FUNCTION_L  (via drill 0.81)
  Top 0.406: 85.09,109.22 v104.14,109.22 | 85.09,109.22 E4.12 | E2.3 54.61,115.57 60.96,115.57 67.31,109.22 85.09,109.22
  Bottom 0.406: U$1.AH2 116.84,109.22 v104.14,109.22
DEN8_L
  Top 0.813: U$1.BM1 117.17,26.34 116.84,26.67 107.95,26.67 D3.C R34.1 R35.2
ENDPOINT_L
  Bottom 0.406: U$1.BH2 116.84,39.37 105.41,39.37 99.06,50.8 86.36,50.8 83.82,53.34 81.28,53.34 71.12,44.45 71.12,41.91 D6.C
GND  (via drill 0.81)
  Top 0.813: U$1.BT1 116.84,10.16 96.52,10.16 | 96.52,10.16 C2.+ 93.98,5.08 74.93,5.08 73.66,6.35 74.93,10.16 73.66,11.43 58.42,11.43 55.88,13.97 52.07,13.97 50.8,12.7 50.8,10.16 46.99,6.35 43.18,6.35 35.56,10.16 34.29,11.43 | 96.52,10.16 C1.+ | E4.7 92.71,100.33 C12.2 | C12.2 49.53,100.33 E5.1 | C10.2 101.6,118.11 E1.7 92.71,120.65 74.93,120.65 C8.2 | C11.2 67.31,118.11 E2.7 59.69,120.65 40.64,120.65 C13.2 E3.7 | U$1.AT1 117.17,80.34 116.84,80.01 105.41,80.01 99.06,86.36 Q7.1 | E5.1 C14.2 39.37,101.6 39.37,105.41 Q13.1 | D4.A D3.A | R62.1 R61.1 39.37,26.67 39.37,31.75 40.64,34.29 40.64,39.37 | C16.2 62.23,60.96 54.61,60.96 Q17.1 49.53,58.42 43.18,63.5 Q21.1 | 40.64,39.37 Q31.3 44.45,26.67 50.8,20.32 53.34,19.05 54.61,17.78 Q23.1 C20.2 | 40.64,39.37 40.64,43.18 R68.2 v29.21,50.8 | D1.C 35.56,13.97 34.29,11.43 | 34.29,11.43 R4.2 | Q15.1 C5.2 C4.2 62.23,91.44 58.42,95.25 49.53,95.25 E5.1 | C6.2 73.66,92.71 C12.2 | C9.- 11.43,8.89 11.43,17.78 16.51,22.86 Q26.1 | Q20.1 33.02,66.04 C18.2 25.4,74.93 Q18.1
  Bottom 0.813: C1.+ 92.71,22.86 90.17,25.4 83.82,25.4 82.55,24.13 78.74,27.94 78.74,30.48 82.55,33.02 85.09,36.83 D4.A | E4.7 Q7.1 100.33,81.28 100.33,62.23 106.68,52.07 116.84,52.07 U$1.BC2 | U$1.AC2 117.73,121.92 109.22,121.92 C10.2 | Q26.1 21.59,25.4 21.59,44.45 Q29.1 24.13,52.07 24.13,55.88 25.4,57.15 29.21,57.15 | 29.21,57.15 v29.21,50.8 | 29.21,57.15 Q20.1 | C11.2 C8.2 | Q15.1 46.99,78.74 46.99,73.66 45.72,72.39 45.72,71.12 48.26,68.58 48.26,67.31 52.07,62.23 Q17.1 | C13.2 38.1,118.11 36.83,116.84 Q13.1 | D3.A 83.82,39.37 Q5.1 | R61.1 35.56,24.13 34.29,22.86 34.29,17.78 35.56,16.51 D9.C D1.C | C6.2 77.47,83.82 80.01,81.28 Q4.1 | Q21.1 39.37,63.5 35.56,67.31 C18.2 | D2.A 22.86,107.95 19.05,107.95 13.97,104.14 D8.A 11.43,101.6 19.05,96.52 19.05,93.98 17.78,90.17 Q18.1
LOCAL_L
  Top 0.406: U$1.AH1 117.17,108.89 116.84,109.22 110.49,109.22 106.68,114.3 101.6,114.3 100.33,115.57 92.71,115.57 E1.5
LRCC_STROBE_H
  Top 0.406: Q29.3 16.51,44.45 20.32,44.45 R71.1
  Bottom 0.406: U$1.BR2 116.84,16.51 107.95,16.51 100.33,10.16 83.82,10.16 81.28,12.7 68.58,12.7 63.5,7.62 49.53,7.62 45.72,11.43 44.45,11.43 40.64,7.62 33.02,7.62 30.48,11.43 30.48,46.99 R71.1
MATCH1_H
  Top 0.406: U$1.AN1 117.17,93.04 116.84,92.71 106.68,92.71 102.87,96.52 93.98,96.52 E4.6
  Bottom 0.406: E4.6 95.25,101.6 96.52,101.6 99.06,104.14 99.06,106.68 E1.4
MATCH2_H
  Top 0.406: U$1.AR1 117.17,86.69 116.84,86.36 107.95,86.36 100.33,93.98 88.9,93.98 E4.3
  Bottom 0.406: E1.2 85.09,115.57 87.63,115.57 97.79,105.41 97.79,104.14 96.52,102.87 93.98,102.87 91.44,100.33 87.63,100.33 E4.3
MATCH4_H
  Top 0.406: U$1.AL1 117.17,99.39 116.84,99.06 109.22,99.06 100.33,105.41 E4.8
  Bottom 0.406: E1.1 85.09,113.03 85.09,109.22 86.36,107.95 92.71,107.95 E4.8
MUX_OUT_L
  Top 0.406: U$1.AE1 117.17,115.24 116.84,115.57 109.22,115.57 106.68,118.11 106.68,123.19 100.33,129.54 58.42,129.54 E2.11 | R8.1 59.69,114.3 57.15,114.3 E5.12
  Bottom 0.406: E2.11 58.42,121.92 62.23,121.92 64.77,119.38 64.77,118.11 62.23,115.57 57.15,115.57 55.88,114.3 55.88,109.22 E5.12 55.59,100.14 | E5.5 55.59,100.14 | E5.7 59.69,100.33 55.88,100.33 55.59,100.14
N$1
  Top 0.406: E3.13 16.51,128.27 13.97,128.27 10.16,124.46 10.16,113.03 C7.1 R58.1
N$2
  Bottom 0.406: R3.1 34.29,92.71 33.02,91.44 33.02,88.9 34.29,87.63 Q2.3
N$3
  Top 0.406: R1.2 34.29,95.25 34.29,88.9 36.83,86.36 Q2.2
N$4  (via drill 0.81)
  Top 0.406: E3.2 20.32,116.84 38.1,116.84 40.64,119.38 53.34,119.38 E2.4 | v50.8,107.95 40.64,107.95 38.1,110.49 35.56,109.22 34.29,109.22 | 34.29,109.22 33.02,109.22 31.75,110.49 24.13,102.87 24.13,97.79 R2.1 R3.2 | 34.29,109.22 34.29,105.41 D2.C
  Bottom 0.406: E2.4 54.61,110.49 v50.8,107.95
N$5
  Top 0.406: E3.3 E3.4
  Bottom 0.406: R73.1 E3.3
N$6
  Bottom 0.406: E3.11 25.4,128.27 33.02,128.27 34.29,127 34.29,116.84 21.59,110.49 C7.2
N$7
  Top 0.406: R6.2 Q1.3
N$8
  Top 0.406: Q1.2 R72.2 D1.A
  Bottom 0.406: Q1.2 40.64,17.78 39.37,19.05 39.37,38.1 41.91,40.64 45.72,40.64 Q31.2
N$9
  Top 0.406: R10.2 72.39,54.61 72.39,57.15 74.93,59.69 77.47,59.69 80.01,62.23 Q3.2
N$10
  Bottom 0.406: E2.8 66.04,120.65 66.04,115.57 E5.10
N$12
  Top 0.406: Q3.3 74.93,62.23 71.12,58.42 71.12,55.88 R11.1
  Bottom 0.406: Q3.3 Q4.2
N$13
  Top 0.406: Q4.3 71.12,77.47 68.58,74.93 63.5,74.93 62.23,76.2 R12.1
  Bottom 0.406: E4.10 87.63,102.87 83.82,102.87 82.55,101.6 71.12,101.6 63.5,92.71 63.5,86.36 59.69,83.82 59.69,80.01 60.96,78.74 60.96,77.47 59.69,76.2 R12.1
N$15
  Top 0.406: R36.2 Q12.2
N$16
  Bottom 0.406: Q30.2 77.47,35.56 76.2,34.29 76.2,27.94 74.93,26.67 R14.2
N$17
  Bottom 0.406: Q5.2 77.47,41.91 74.93,39.37 Q30.3 R15.1
N$18  (via drill 0.81)
  Top 0.406: v74.93,57.15 R16.1 72.39,45.72 Q5.3
  Bottom 0.406: E4.1 69.85,87.63 69.85,81.28 72.39,78.74 72.39,66.04 71.12,64.77 71.12,58.42 72.39,57.15 v74.93,57.15
N$20
  Bottom 0.406: R18.2 91.44,66.04 Q6.2
N$21
  Bottom 0.406: R19.1 87.63,74.93 Q6.3 88.9,81.28 92.71,85.09 Q7.2
N$22
  Top 0.406: R20.1 Q7.3
  Bottom 0.406: E4.4 87.63,96.52 85.09,93.98 83.82,93.98 78.74,88.9 78.74,85.09 80.01,83.82 R20.1
N$23
  Top 0.406: R37.1 13.97,88.9 16.51,91.44 Q12.3
N$24  (via drill 0.81)
  Top 0.406: R40.1 D5.A | E5.6 62.23,95.25 v69.85,95.25
  Bottom 0.406: D5.A 59.69,34.29 63.5,38.1 63.5,60.96 66.04,63.5 66.04,66.04 68.58,68.58 68.58,72.39 64.77,76.2 64.77,91.44 66.04,92.71 v69.85,95.25
N$25
  Top 0.406: E2.1 E2.2 49.53,114.3 48.26,113.03 31.75,113.03 D8.C 22.86,101.6 22.86,90.17 R37.2 R38.1
N$26
  Top 0.406: Q11.3 R31.1
N$27
  Top 0.406: R41.1 D6.A
  Bottom 0.406: E5.11 58.42,101.6 62.23,101.6 63.5,100.33 63.5,96.52 62.23,95.25 57.15,95.25 55.88,93.98 55.88,74.93 57.15,73.66 62.23,73.66 63.5,72.39 63.5,68.58 62.23,67.31 62.23,43.18 D6.A
N$28
  Top 0.406: R32.2 92.71,26.67 Q11.2
N$29
  Top 0.813: R31.2 99.06,29.21 100.33,30.48 100.33,33.02 99.06,34.29 R30.1 D4.C
  Bottom 0.813: U$1.BK2 116.84,33.02 100.33,33.02 R30.1
N$30
  Top 0.406: R35.1 88.9,44.45 90.17,45.72 Q10.3
N$31
  Top 0.406: R42.1 D7.A
  Bottom 0.406: E5.4 54.61,73.66 55.88,72.39 60.96,72.39 62.23,71.12 62.23,68.58 60.96,67.31 60.96,66.04 57.15,59.69 57.15,55.88 60.96,52.07 60.96,46.99 D7.A
N$32
  Top 0.406: R33.2 87.63,55.88 88.9,57.15 Q10.2
N$33
  Bottom 0.406: E5.2 49.53,95.25 44.45,90.17 R43.1
N$34
  Bottom 0.406: E5.13 49.53,102.87 R48.1
N$35
  Bottom 0.406: E5.3 52.07,95.25 49.53,92.71 49.53,87.63 53.34,83.82 53.34,81.28 49.53,77.47 49.53,74.93 50.8,73.66 50.8,71.12 49.53,69.85 49.53,67.31 54.61,62.23 54.61,49.53 R53.1
N$36
  Bottom 0.406: E5.14 46.99,107.95 50.8,111.76 R29.1
N$37
  Top 0.406: R29.2 35.56,111.76 Q13.2
  Bottom 0.406: R28.1 34.29,107.95 Q13.2
N$38
  Top 0.406: Q15.2 48.26,83.82 R44.1 R43.2
N$39
  Top 0.406: R49.1 Q18.2 13.97,82.55 16.51,85.09 24.13,85.09 26.67,87.63 R48.2
N$40
  Top 0.406: R54.1 R53.2
  Bottom 0.406: R53.2 44.45,49.53 44.45,53.34 43.18,54.61 43.18,59.69 44.45,60.96 44.45,63.5 41.91,66.04 Q21.2
N$41
  Bottom 0.406: E4.13 81.28,102.87 71.12,102.87 63.5,93.98 59.69,93.98 R39.2
N$46
  Bottom 0.406: R55.2 C19.1 Q22.2
N$47
  Top 0.406: Q19.2 C17.1
  Bottom 0.406: R50.2 20.32,67.31 17.78,69.85 17.78,72.39 20.32,77.47 Q19.2
N$48
  Top 0.406: Q16.2 48.26,72.39 R45.2
  Bottom 0.406: R45.2 52.07,73.66 55.88,69.85 C15.1
N$49
  Top 0.406: Q28.2 16.51,54.61 19.05,52.07 R69.2
N$50
  Top 0.406: Q24.2 19.05,16.51 R61.2 R59.1
N$51
  Top 0.406: Q24.3 13.97,17.78 16.51,20.32 20.32,20.32 21.59,21.59 21.59,24.13 R60.1
N$52
  Top 0.406: Q22.3 53.34,20.32 Q23.2 55.88,19.05 64.77,19.05 C20.1
  Bottom 0.406: R56.1 58.42,24.13 Q23.2
N$53
  Top 0.406: R46.1 C16.1
  Bottom 0.406: Q16.3 Q17.2 49.53,57.15 R46.1
N$54
  Top 0.406: R51.1 26.67,64.77 | 26.67,64.77 Q20.2 | 26.67,64.77 C18.1 Q19.3
N$55
  Top 0.406: R70.1 Q29.2 Q28.3
N$56
  Top 0.406: Q25.2 19.05,33.02 R66.2
N$57
  Top 0.406: Q25.1 D10.A
N$58
  Top 0.406: Q27.2 21.59,40.64 R67.2 D10.C
N$59
  Top 0.406: Q25.3 16.51,27.94 19.05,27.94 R65.1
N$60
  Top 0.406: Q26.2 20.32,25.4 R63.1 R65.2
R_FWD
  Top 0.406: U$1.BJ1 117.17,35.89 116.84,35.56 111.76,35.56 100.33,49.53 100.33,67.31 99.06,68.58 77.47,68.58 66.04,57.15 63.5,57.15 60.96,59.69 57.15,59.69 53.34,55.88 49.53,55.88 Q17.3
  Bottom 0.406: R47.1 50.8,49.53 46.99,57.15 Q17.3
R_REW
  Top 0.406: U$1.BF1 117.12,42.19 116.84,41.91 111.76,41.91 102.87,50.8 102.87,67.31 97.79,72.39 74.93,72.39 67.31,64.77 45.72,64.77 41.91,68.58 38.1,68.58 35.56,66.04 35.56,59.69 34.29,58.42 30.48,58.42 Q20.3 R52.1
R_RWE
  Top 0.406: U$1.BN1 117.17,23.19 116.84,22.86 99.06,22.86 96.52,20.32 95.25,20.32 88.9,17.78 81.28,17.78 73.66,25.4 62.23,25.4 R57.1
  Bottom 0.406: R57.1 55.88,26.67 55.88,24.13 52.07,20.32 Q23.3
REWIND_STATUS_L
  Bottom 0.406: U$1.BF2 116.84,41.91 106.68,41.91 100.33,52.07 87.63,52.07 85.09,54.61 80.01,54.61 D7.C
SELECT_REMOTE_H  (via drill 0.81)
  Top 0.406: U$1.AK1 117.14,102.56 116.84,102.87 110.49,102.87 104.14,111.76 R27.1 91.44,111.76 88.9,114.3 69.85,114.3 67.31,116.84 58.42,116.84 E2.5 | E3.1 16.51,115.57 20.32,111.76 27.94,111.76 30.48,114.3 v46.99,114.3
  Bottom 0.406: E2.5 E2.13 53.34,121.92 46.99,121.92 44.45,119.38 44.45,116.84 v46.99,114.3 | E1.8 97.79,123.19 R27.1
SELECT_REMOTE_L
  Top 0.406: E1.12 E1.13 | U$1.AF1 117.12,112.04 116.84,111.76 110.49,111.76 105.41,116.84 105.41,121.92 99.06,128.27 95.25,128.27 E1.9
  Bottom 0.406: E1.6 E1.9 E1.10 90.17,127 88.9,128.27 86.36,128.27 85.09,127 E1.12 85.09,124.46 82.55,121.92 80.01,121.92 77.47,119.38 77.47,114.3 74.93,111.76 R26.1 68.58,105.41 66.04,105.41 63.5,107.95 60.96,107.95 E5.9
SET_FUNCTION_L
  Top 0.406: U$1.AD1 117.14,118.42 116.84,118.11 109.22,118.11 107.95,119.38 107.95,124.46 101.6,130.81 57.15,130.81 E2.12
  Bottom 0.406: E2.6 E2.12
SET_PULSE_H
  Bottom 0.406: E3.8 29.21,123.19 15.24,123.19 7.62,115.57 7.62,13.97 25.4,2.54 100.33,2.54 104.14,3.81 116.84,3.81 U$1.BV2
SET_PULSE_L
  Bottom 0.406: E3.6 26.67,120.65 15.24,120.65 8.89,114.3 8.89,81.28 11.43,78.74 11.43,73.66 8.89,71.12 8.89,60.96 10.16,59.69 10.16,20.32 15.24,15.24 22.86,6.35 26.67,3.81 99.06,3.81 106.68,7.62 116.84,7.62 117.2,7.26 U$1.BU2
SW1
  Top 0.406: U$1.AP1 117.17,89.84 116.84,90.17 106.68,90.17 101.6,95.25 92.71,95.25 E4.5 | R21.1 C6.1
  Bottom 0.406: E4.5 90.17,96.52 85.09,88.9 C6.1
SW2
  Top 0.406: U$1.AS1 117.14,83.52 116.84,83.82 107.95,83.82 99.06,92.71 87.63,92.71 E4.2 80.01,95.25 80.01,88.9 78.74,87.63 71.12,87.63 69.85,86.36 69.85,83.82 C5.1 R17.1
SW4
  Top 0.406: U$1.AM1 117.17,96.19 116.84,96.52 105.41,96.52 99.06,102.87 95.25,102.87 E4.9 | R13.1 C4.1
  Bottom 0.406: E4.9 88.9,101.6 85.09,101.6 83.82,100.33 80.01,100.33 C4.1
V_CLAMP
  Top 0.406: U$1.BU1 117.17,7.29 116.84,7.62 106.68,7.62 99.06,3.81 31.75,3.81 C9.+ 24.13,7.62 Q24.1 R62.2
VCC  (via drill 0.81)
  Top 0.813: E5.8 C12.1 E4.14 | R26.2 R27.2 | C10.1 83.82,121.92 E1.14 78.74,127 71.12,127 C11.1 67.31,123.19 49.53,123.19 E2.14 C13.1 35.56,123.19 16.51,123.19 | E5.8 62.23,107.95 R25.2 | v106.68,66.04 106.68,67.31 v97.79,76.2 | 16.51,123.19 E3.14 | C14.1 43.18,102.87 59.69,102.87 E5.8 | R19.2 82.55,57.15 R16.2 82.55,46.99 R34.2 | R34.2 85.09,39.37 80.01,39.37 77.47,41.91 72.39,36.83 R41.2 | R15.2 82.55,31.75 R30.2 88.9,34.29 90.17,35.56 90.17,40.64 88.9,41.91 R34.2 | R41.2 66.04,34.29 R40.2 R57.2 R56.2 | R41.2 66.04,39.37 R42.2 66.04,44.45 66.04,46.99 R11.2 | R59.2 R60.2 R63.2 39.37,35.56 39.37,39.37 R64.2 | R46.2 R47.2 R71.2 R70.2 29.21,54.61 26.67,57.15 21.59,57.15 15.24,62.23 R52.2 R51.2 | R21.2 R20.2 69.85,81.28 69.85,78.74 R12.2 64.77,78.74 | R17.2 64.77,78.74 | R39.1 64.77,88.9 64.77,78.74 | R13.2 53.34,92.71 50.8,92.71 44.45,85.09 41.91,85.09 39.37,87.63 39.37,92.71 R2.2 | 16.51,123.19 13.97,120.65 13.97,114.3 | 13.97,114.3 15.24,113.03 15.24,105.41 | 13.97,114.3 R73.2 | 15.24,105.41 R58.2 | R38.2 8.89,88.9 8.89,96.52 15.24,102.87 15.24,105.41
  Bottom 0.813: E4.14 80.01,107.95 | 80.01,107.95 R8.2 | 80.01,107.95 80.01,110.49 R26.2 | U$1.AA2 117.64,128.27 109.22,128.27 C10.1 | U$1.BA2 116.84,58.42 107.95,58.42 v106.68,66.04 | R19.2 v97.79,76.2 | C13.1 40.64,121.92 40.64,114.3 39.37,113.03 39.37,110.49 41.91,107.95 C14.1 41.91,105.41 34.29,105.41 33.02,104.14 33.02,96.52 34.29,95.25 R2.2 | R64.2 35.56,41.91 34.29,43.18 34.29,48.26 35.56,49.53 R71.2 | R13.2 R17.2 | R12.2 69.85,73.66 69.85,66.04 68.58,64.77 R11.2 | R38.2 13.97,82.55 16.51,80.01 13.97,77.47 15.24,76.2 15.24,67.31 R51.2
WRITE_STROBE_H
  Top 0.406: Q26.3 11.43,25.4 11.43,31.75 15.24,35.56 19.05,35.56 R64.1
  Bottom 0.406: U$1.BT2 117.71,10.16 106.68,10.16 97.79,5.08 26.67,5.08 24.13,7.62 24.13,40.64 25.4,41.91 R64.1

### Text on the board
Top: S | + | CS * A B C D E F H J K L M N P R S T | + | +
Bottom: S | BUS TRANSCEIVER M514H